# EasyEDA schematic 小车编码器支持板_2021-05-24.json
TITLE: Sheet_1; REV: 1.0; Date: 2021-05-24; Sheet: 1/1; Drawn By: Kami; Company: Your Company
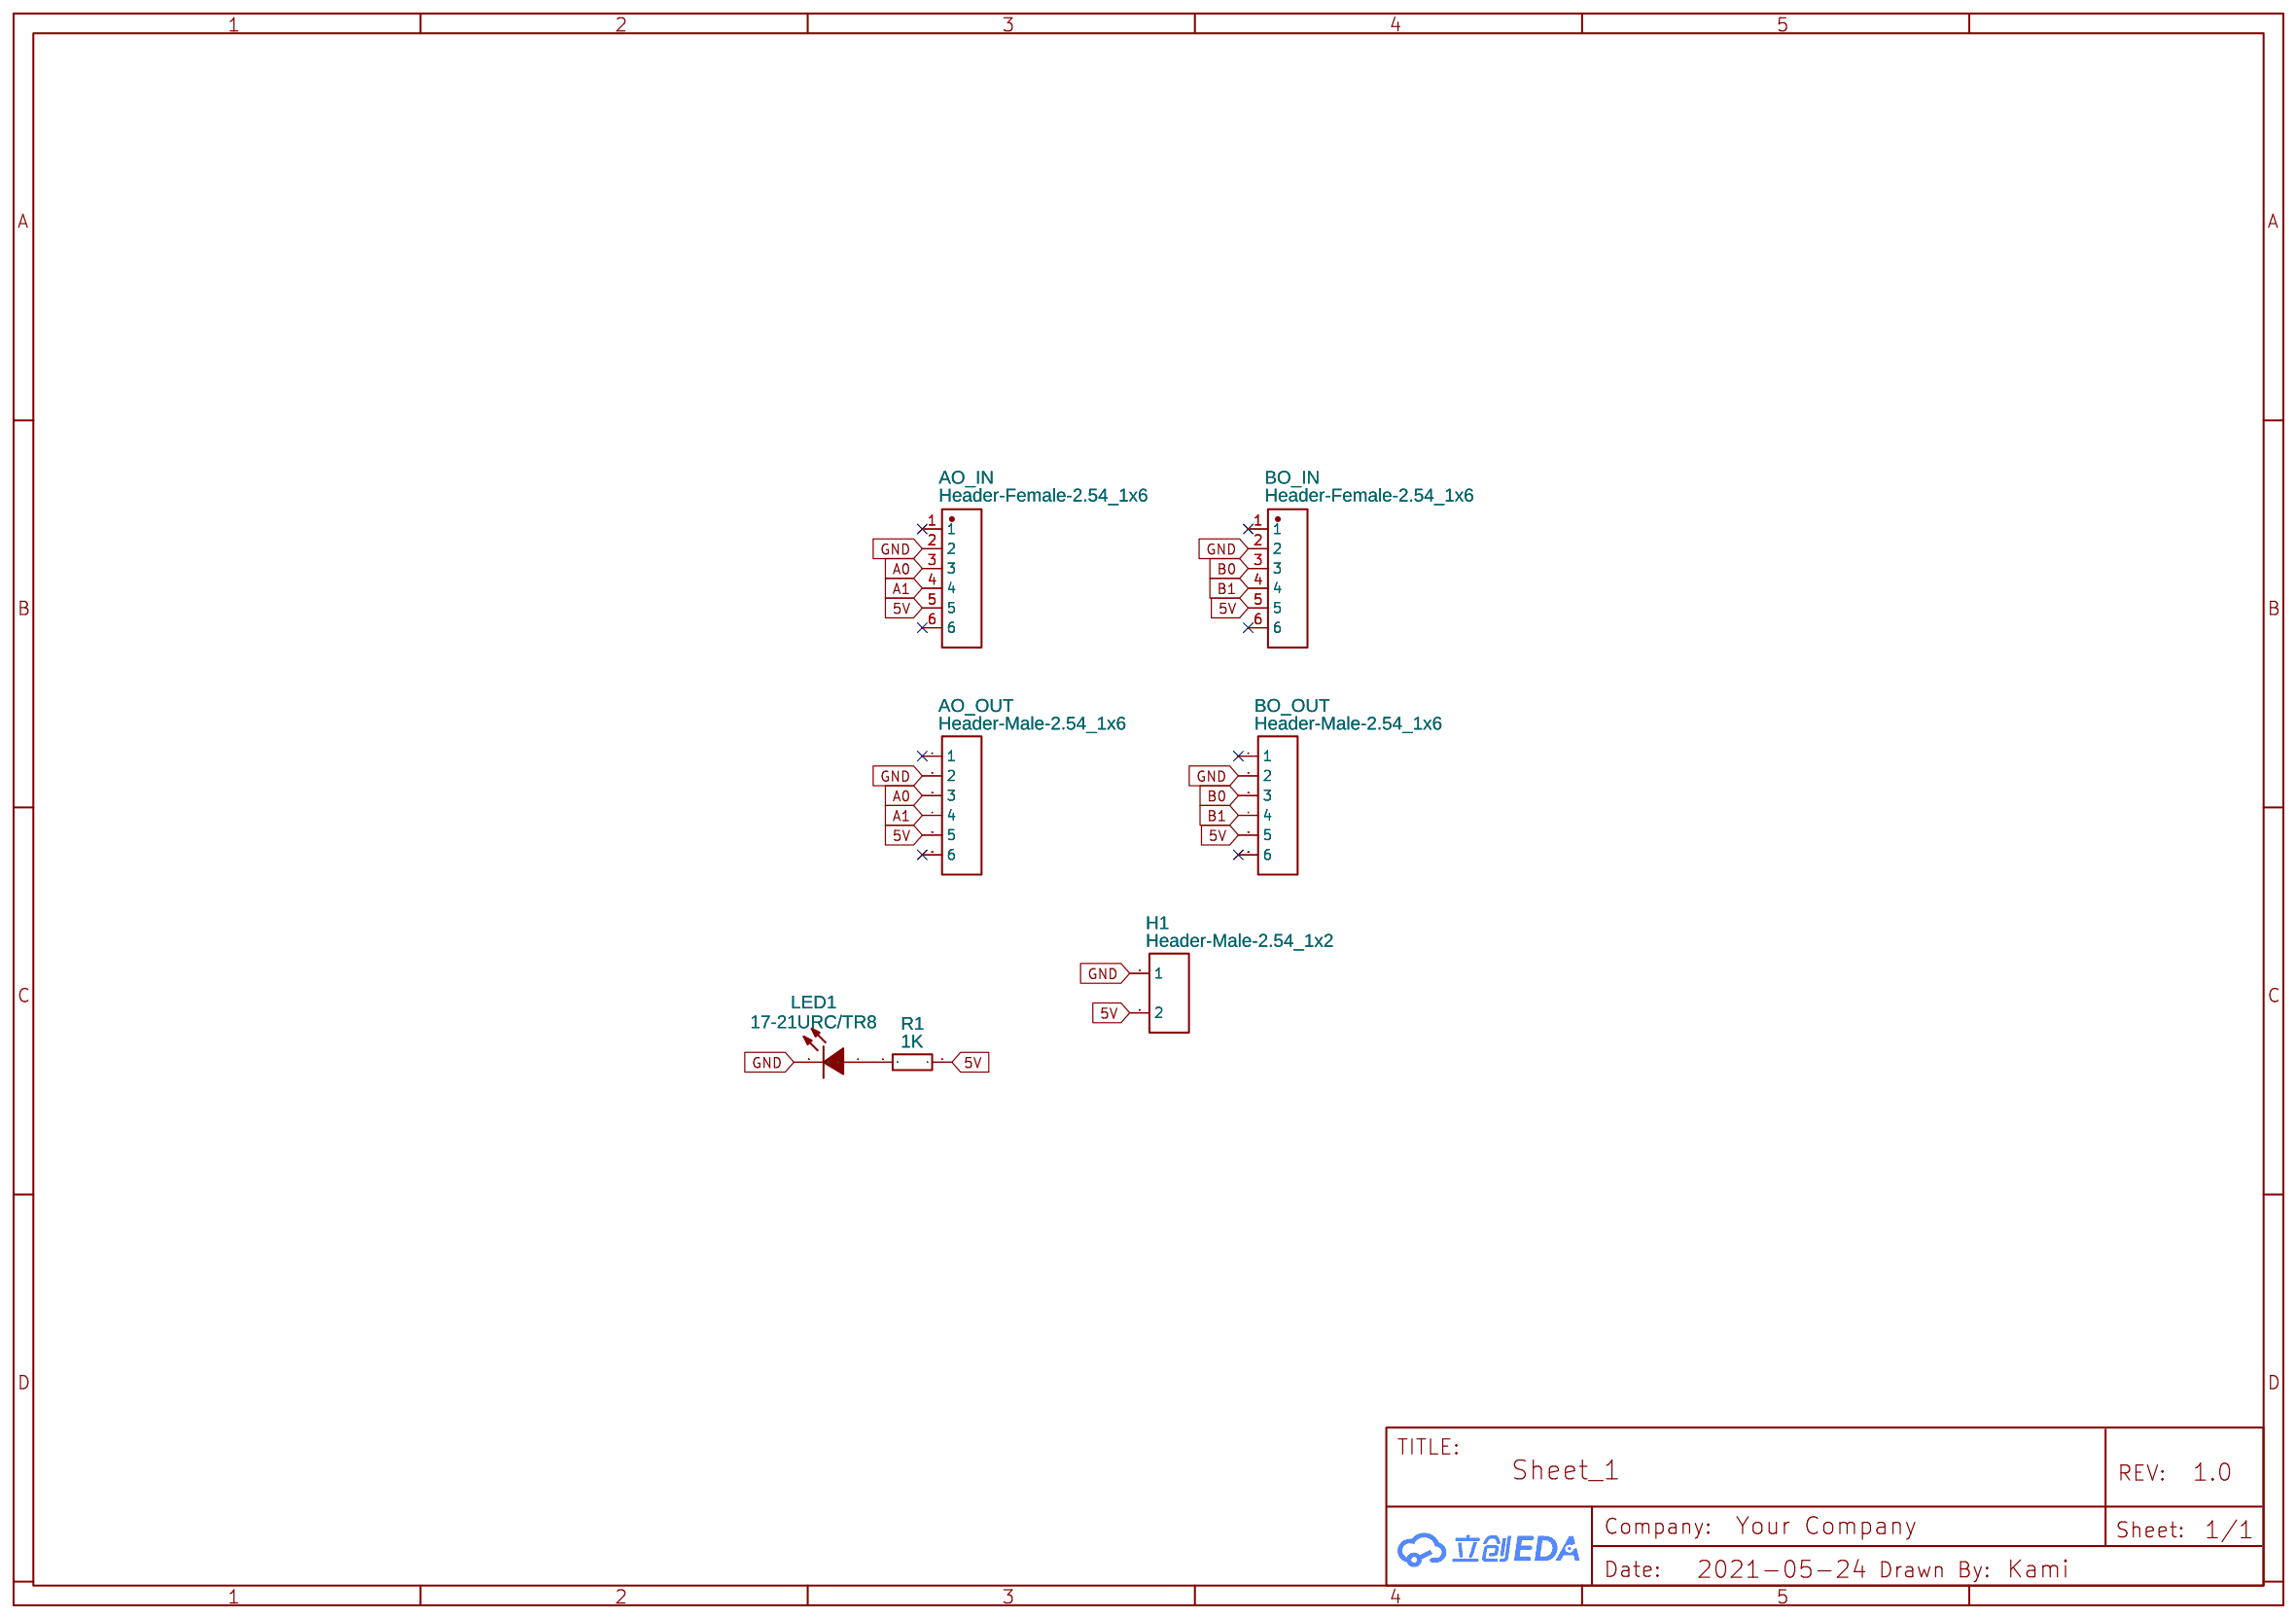
[diagram p0: schematic sheet]

## Parts
AO_IN  Header-Female-2.54_1x6  [HDR-TH_6P-P2.54-V-F]
AO_OUT  Header-Male-2.54_1x6  [HDR-TH_6P-P2.54-V]
BO_IN  Header-Female-2.54_1x6  [HDR-TH_6P-P2.54-V-F]
BO_OUT  Header-Male-2.54_1x6  [HDR-TH_6P-P2.54-V]
H1  Header-Male-2.54_1x2  [HDR-TH_2P-P2.54-V]
LED1  17-21URC/TR8  [LED0805-R-RD]
R1  1K  [R0805]

## Library data of the parts
AO_IN BO_IN = Header-Female-2.54_1x6: Supplier: LCSC; Manufacturer: BOOMELE; Manufacturer Part: Female header 1*6p; Supplier Part: C40877; JLCPCB Part Class: Extended Part
AO_OUT BO_OUT = Header-Male-2.54_1x6: Supplier: LCSC; Manufacturer: BOOMELE; Supplier Part: C37208; JLCPCB Part Class: Extended Part
H1 = Header-Male-2.54_1x2: Supplier: LCSC; Manufacturer: TE Connectivity; Manufacturer Part: 826629-2; Supplier Part: C86471; JLCPCB Part Class: Extended Part
LED1 = 17-21URC/TR8: Supplier: LCSC; Supplier Part: C264414; Manufacturer: Everlight Elec; Contributor: LCSC
R1 = AF0805FR-071KL: Supplier: LCSC; Supplier Part: C192907; Manufacturer: YAGEO; Contributor: LCSC; JLCPCB Part Class: Extended Part

## Nets
5V: AO_IN.5 AO_OUT.5 BO_IN.5 BO_OUT.5 H1.2 R1.2
GND: AO_IN.2 AO_OUT.2 BO_IN.2 BO_OUT.2 H1.1 LED1.2(K)
A0: AO_IN.3 AO_OUT.3
A1: AO_IN.4 AO_OUT.4
B0: BO_IN.3 BO_OUT.3
B1: BO_IN.4 BO_OUT.4
Net-(LED1-1): LED1.1(A) R1.1

Not connected (* = marked no-connect by the designer): AO_IN 1* 6*; AO_OUT 1* 6*; BO_IN 1* 6*; BO_OUT 1* 6*
